# EAGLE design Driver (EAGLE 9.6.2)
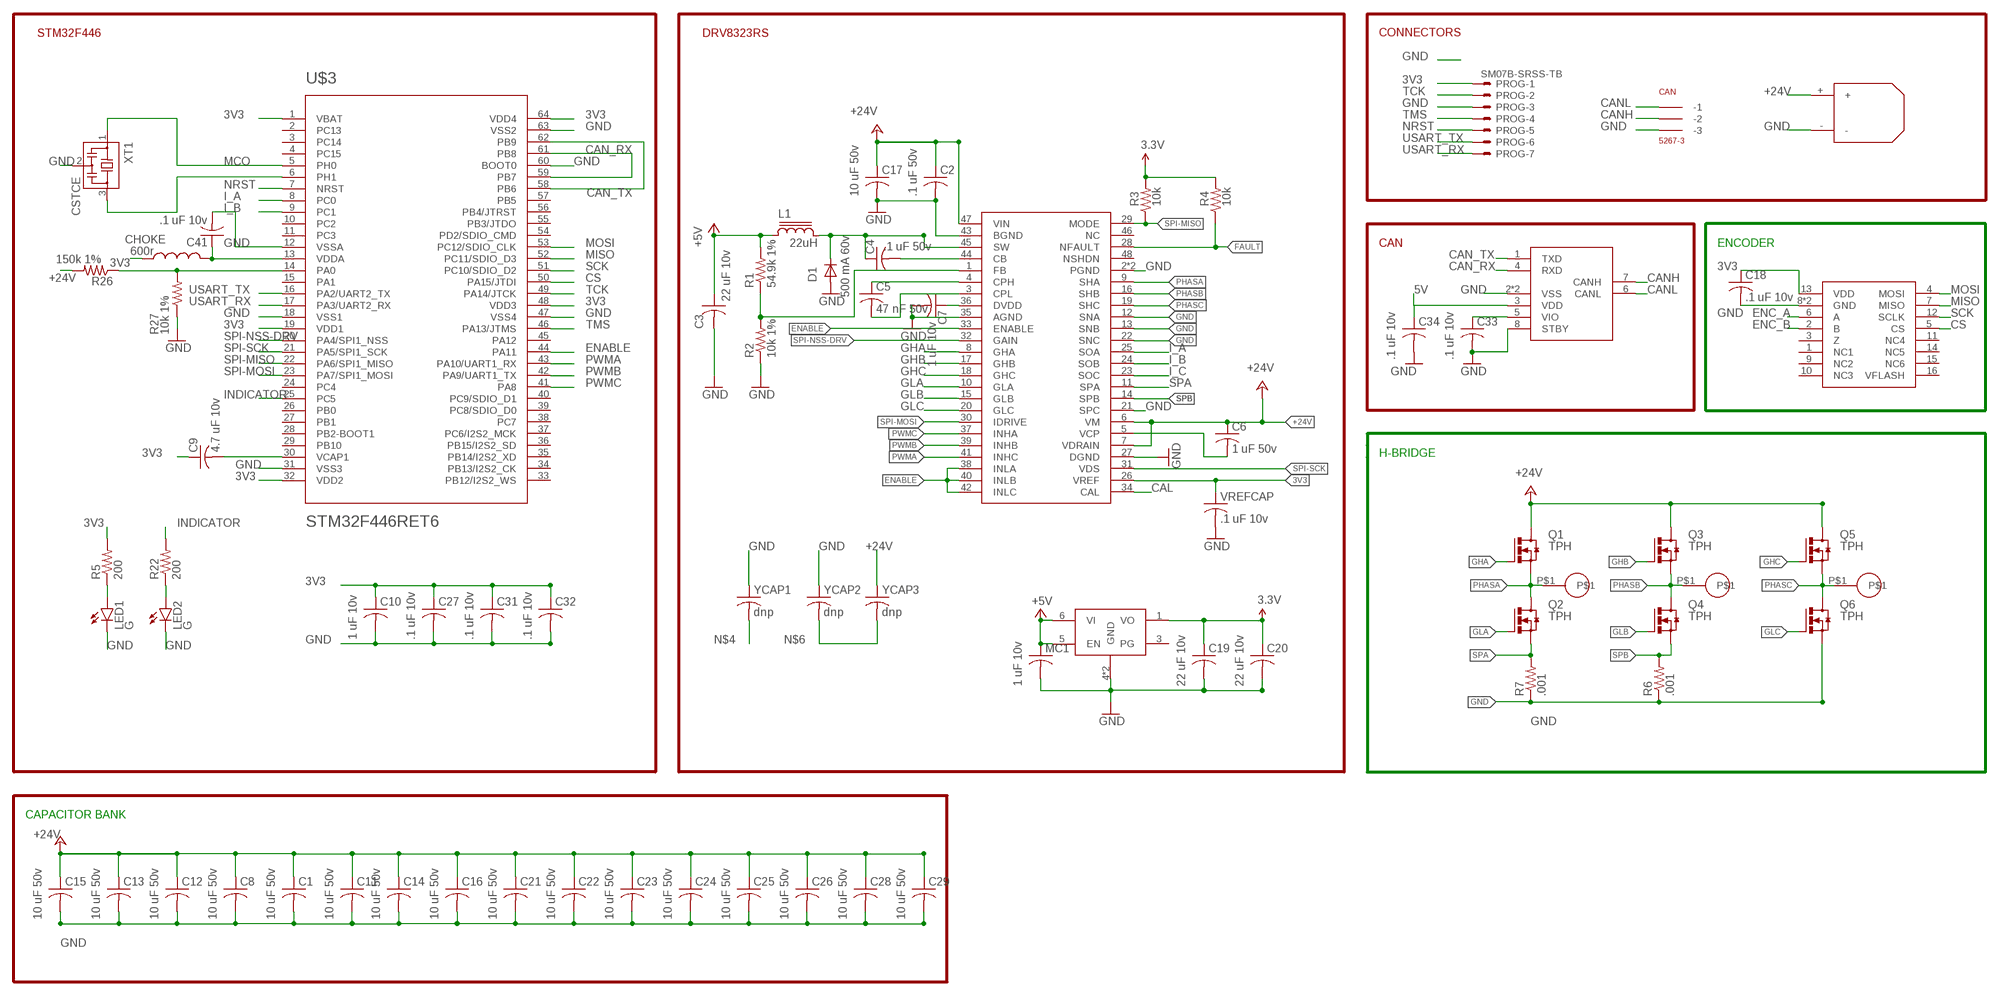
[diagram p0: schematic, sheet 1]

## Parts
C1  10 uF 50v  C-USC1206K  [C1206K]
C2  .1 uF 50v  C-USC0603K  [C0603K]
C3  22 uF 10v  C-USC0603K  [C0603K]
C4  .1 uF 50v  C-USC0603K  [C0603K]
C5  47 nF 50v  C-USC0402K  [C0402K]
C6  1 uF 50v  C-USC0603K  [C0603K]
C7  1 uF 10v  C-USC0402K  [C0402K]
C8  10 uF 50v  C-USC1206K  [C1206K]
C9  4.7 uF 10v  C-USC0402K  [C0402K]
C10  1 uF 10v  C-USC0402K  [C0402K]
C11  10 uF 50v  C-USC1206K  [C1206K]
C12  10 uF 50v  C-USC1206K  [C1206K]
C13  10 uF 50v  C-USC1206K  [C1206K]
C14  10 uF 50v  C-USC1206K  [C1206K]
C15  10 uF 50v  C-USC1206K  [C1206K]
C16  10 uF 50v  C-USC1206K  [C1206K]
C17  10 uF 50v  C-USC1206K  [C1206K]
C18  .1 uF 10v  C-USC0402K  [C0402K]
C19  22 uF 10v  C-USC0603K  [C0603K]
C20  22 uF 10v  C-USC0603K  [C0603K]
C21  10 uF 50v  C-USC1206K  [C1206K]
C22  10 uF 50v  C-USC1206K  [C1206K]
C23  10 uF 50v  C-USC1206K  [C1206K]
C24  10 uF 50v  C-USC1206K  [C1206K]
C25  10 uF 50v  C-USC1206K  [C1206K]
C26  10 uF 50v  C-USC1206K  [C1206K]
C27  .1 uF 10v  C-USC0402K  [C0402K]
C28  10 uF 50v  C-USC1206K  [C1206K]
C29  10 uF 50v  C-USC1206K  [C1206K]
C31  .1 uF 10v  C-USC0402K  [C0402K]
C32  .1 uF 10v  C-USC0402K  [C0402K]
C33  .1 uF 10v  C-USC0402K  [C0402K]
C34  .1 uF 10v  C-USC0402K  [C0402K]
C41  .1 uF 10v  C-USC0402K  [C0402K]
CAN  5267-3  [5267-3]
CHOKE  600r  INDUCTOR0603  [0603]
D1  500 mA 60v  DIODE-SOD123  [SOD123]
L1  22uH  SDR0302  [SDR0302]
LDFM33PUR  LDFM  [DFN6-3X3]
LED1  G  LED0603  [LED-0603]
LED2  G  LED0603  [LED-0603]
MC1  1 uF 10v  C-USC0402K  [C0402K]
PROG  SM07B-SRSS-TB  [SM07B-SRSS-TB]
Q1  TPH  [TRANS_TPH5900CNH,L1Q]
Q2  TPH  [TRANS_TPH5900CNH,L1Q]
Q3  TPH  [TRANS_TPH5900CNH,L1Q]
Q4  TPH  [TRANS_TPH5900CNH,L1Q]
Q5  TPH  [TRANS_TPH5900CNH,L1Q]
Q6  TPH  [TRANS_TPH5900CNH,L1Q]
R1  54.9k 1%  R-US_R0402  [R0402]
R2  10k 1%  R-US_R0402  [R0402]
R3  10k  R-US_R0402  [R0402]
R4  10k  R-US_R0402  [R0402]
R5  200  R-US_R0402  [R0402]
R6  .001  R-US_R1210  [R1210]
R7  .001  R-US_R1210  [R1210]
R22  200  R-US_R0402  [R0402]
R26  150k 1%  R-US_R0402  [R0402]
R27  10k 1%  R-US_R0402  [R0402]
U$1  DRV8323RH  [QFN50P700X700X90-49N]
U$2  18_AWG_PAD  [18_AWG_PAD]
U$3  STM32F446RET6  [TQFP64]
U$4  18_AWG_PAD  [18_AWG_PAD]
U$5  18_AWG_PAD  [18_AWG_PAD]
U$6  MCP2542  [TDFN]
U$9  XT30  [XT30_HORIZONTAL]
U$11  MA700  [QFN16]
VREFCAP  .1 uF 10v  C-USC0402K  [C0402K]
XT1  CSTCE  [CSTCE]
YCAP1  dnp  C-USC0402K  [C0402K]
YCAP2  dnp  C-USC0402K  [C0402K]
YCAP3  dnp  C-USC0402K  [C0402K]

## Nets
3V3: C9.1 C10.1 C18.1 C19.1 C20.1 C27.1 C31.1 C32.1 C33.1 CHOKE.1 LDFM33PUR.1(VO) PROG.1 R3.2 R4.2 R5.2 U$1.26(VREF) U$3.1(VBAT) U$3.19(VDD1) U$3.32(VDD2) U$3.48(VDD3) U$3.64(VDD4) U$6.5(VIO) U$11.13(VDD) VREFCAP.1 ; supply symbol labelled 3.3V
5V: C3.1 C34.1 L1.1 LDFM33PUR.5(EN) LDFM33PUR.6(VI) MC1.1 R1.2 U$6.3(VDD) ; supply symbol labelled +5V
+24V: C1.1 C2.1 C6.1 C8.1 C11.1 C12.1 C13.1 C14.1 C15.1 C16.1 C17.1 C21.1 C22.1 C23.1 C24.1 C25.1 C26.1 C28.1 C29.1 Q1.5(D) Q1.6(D) Q1.7(D) Q1.8(D) Q1.EP(D) Q3.5(D) Q3.6(D) Q3.7(D) Q3.8(D) Q3.EP(D) Q5.5(D) Q5.6(D) Q5.7(D) Q5.8(D) Q5.EP(D) R26.2 U$1.6(VM) U$1.7(VDRAIN) U$1.47(VIN) U$9.+ YCAP3.1
BOOT: C4.2 U$1.44(CB)
CAL: U$1.34(CAL)
CAN_RX: U$3.59(PB7) U$3.61(PB8) U$6.4(RXD)
CAN_TX: U$3.58(PB6) U$3.62(PB9) U$6.1(TXD)
CANH: CAN.P$2(-2) U$6.7(CANH)
CANL: CAN.P$1(-1) U$6.6(CANL)
CPH: C5.1 U$1.4(CPH)
CPL: C5.2 U$1.3(CPL)
CS: U$3.50(PA15/JTDI) U$11.5(CS)
DEVICE3.3: C7.1 U$1.36(DVDD)
ENABLE: U$1.33(ENABLE) U$1.38(INLA) U$1.40(INLB) U$1.42(INLC) U$3.44(PA11)
ENC_A: U$11.6(A)
ENC_B: U$11.2(B)
FAULT: R4.1 U$1.28(NFAULT)
FB: R1.1 R2.2 U$1.1(FB)
GHA: Q1.4(G) U$1.8(GHA)
GHB: Q3.4(G) U$1.17(GHB)
GHC: Q5.4(G) U$1.18(GHC)
GLA: Q2.4(G) U$1.10(GLA)
GLB: Q4.4(G) U$1.15(GLB)
GLC: Q6.4(G) U$1.20(GLC)
GND: C1.2 C2.2 C3.2 C7.2 C8.2 C10.2 C11.2 C12.2 C13.2 C14.2 C15.2 C16.2 C17.2 C18.2 C19.2 C20.2 C21.2 C22.2 C23.2 C24.2 C25.2 C26.2 C27.2 C28.2 C29.2 C31.2 C32.2 C33.2 C34.2 C41.2 CAN.P$3(-3) D1.A LDFM33PUR.4(GND) LDFM33PUR.EXP(GND) LED1.C LED2.C MC1.2 PROG.3 Q6.1(S) Q6.2(S) Q6.3(S) R2.1 R6.1 R7.1 R27.1 U$1.2(PGND) U$1.12(SNA) U$1.13(SNB) U$1.21(SPC) U$1.22(SNC) U$1.27(DGND) U$1.35(AGND) U$1.43(BGND) U$1.49(PGND) U$3.12(VSSA) U$3.18(VSS1) U$3.31(VSS3) U$3.47(VSS4) U$3.60(BOOT0) U$3.63(VSS2) U$6.2(VSS) U$6.8(STBY) U$6.9(VSS) U$9.- U$11.8(GND) U$11.TH(GND) VREFCAP.2 XT1.2 YCAP1.1 YCAP2.1
I_A: U$1.25(SOA) U$3.8(PC0)
I_B: U$1.24(SOB) U$3.9(PC1)
I_C: U$1.23(SOC)
INDICATOR: R22.2 U$3.25(PC5)
MCO: U$3.5(PH0) XT1.1
MISO: U$3.52(PC11/SDIO_D3) U$11.7(MISO)
MOSI: U$3.53(PC12/SDIO_CLK) U$11.4(MOSI)
N$1: LED1.A R5.1
N$2: C41.1 CHOKE.2 U$3.13(VDDA)
N$3: C9.2 U$3.30(VCAP1)
N$4: YCAP1.2
N$6: YCAP2.2 YCAP3.2
N$24: R26.1 R27.2 U$3.14(PA0)
N$28: LED2.A R22.1
N$30: U$3.6(PH1) XT1.3
NRST: PROG.5 U$3.7(NRST)
PHASA: Q1.1(S) Q1.2(S) Q1.3(S) Q2.5(D) Q2.6(D) Q2.7(D) Q2.8(D) Q2.EP(D) U$1.9(SHA) U$4.P$1
PHASB: Q3.1(S) Q3.2(S) Q3.3(S) Q4.5(D) Q4.6(D) Q4.7(D) Q4.8(D) Q4.EP(D) U$1.16(SHB) U$2.P$1
PHASC: Q5.1(S) Q5.2(S) Q5.3(S) Q6.5(D) Q6.6(D) Q6.7(D) Q6.8(D) Q6.EP(D) U$1.19(SHC) U$5.P$1
PWMA: U$1.41(INHC) U$3.43(PA10/UART1_RX)
PWMB: U$1.39(INHB) U$3.42(PA9/UART1_TX)
PWMC: U$1.37(INHA) U$3.41(PA8)
SCK: U$3.51(PC10/SDIO_D2) U$11.12(SCLK)
SPA: Q2.1(S) Q2.2(S) Q2.3(S) R7.2 U$1.11(SPA)
SPB: Q4.1(S) Q4.2(S) Q4.3(S) R6.2 U$1.14(SPB)
SPI-MISO: R3.1 U$1.29(MODE) U$3.22(PA6/SPI1_MISO)
SPI-MOSI: U$1.30(IDRIVE) U$3.23(PA7/SPI1_MOSI)
SPI-NSS-DRV: U$1.32(GAIN) U$3.20(PA4/SPI1_NSS)
SPI-SCK: U$1.31(VDS) U$3.21(PA5/SPI1_SCK)
SW: C4.1 D1.C L1.2 U$1.45(SW)
TCK: PROG.2 U$3.49(PA14/JTCK)
TMS: PROG.4 U$3.46(PA13/JTMS)
USART_RX: PROG.7 U$3.17(PA3/UART2_RX)
USART_TX: PROG.6 U$3.16(PA2/UART2_TX)
VCP: C6.2 U$1.5(VCP)
Unconnected: LDFM33PUR.3(PG) U$1.46(NC) U$1.48(NSHDN) U$3.2(PC13) U$3.3(PC14) U$3.4(PC15) U$3.10(PC2) U$3.11(PC3) U$3.15(PA1) U$3.24(PC4) U$3.26(PB0) U$3.27(PB1) U$3.28(PB2-BOOT1) U$3.29(PB10) U$3.33(PB12/I2S2_WS) U$3.34(PB13/I2S2_CK) U$3.35(PB14/I2S2_XD) U$3.36(PB15/I2S2_SD) U$3.37(PC6/I2S2_MCK) U$3.38(PC7) U$3.39(PC8/SDIO_D0) U$3.40(PC9/SDIO_D1) U$3.45(PA12) U$3.54(PD2/SDIO_CMD) U$3.55(PB3/JTDO) U$3.56(PB4/JTRST) U$3.57(PB5) U$11.1(NC1) U$11.3(Z) U$11.9(NC2) U$11.10(NC3) U$11.11(NC4) U$11.14(NC5) U$11.15(NC6) U$11.16(VFLASH)

## Notes on the sheet
- STM32F446 | DRV8323RS
- CONNECTORS
- CAN | ENCODER
- H-BRIDGE
- CAPACITOR BANK

## Library data of the parts
C1-C29 C31-C34 C41 MC1 VREFCAP YCAP1-YCAP3 = rcl:C-US: CAPACITOR, American symbol
CAN = con-molex-spox:5267-3
CHOKE = SparkFun-Passives:INDUCTOR: Inductors Basic Inductor/Choke - 0603 and 1206. Footprints are not proven and vary greatly between part numbers. INDUCTOR POWER 3.3UH 4.0A SMD 0.197" L x 0.197" W x 0.177" H (5.00mm x 5.00mm x 4.50mm)
D1 = diode:DIODE-: DIODE
L1 = inductor-bourns:SDR0302: POWER INDUCTOR
LDFM33PUR = BenLibrary:LDFM
LED1 LED2 = SparkFun-LED:LED: LEDs Standard schematic elements and footprints for 5mm, 3mm, 1206, and 0603 sized LEDs. 5mm - Spark Fun Electronics SKU : COM-00529 (and others)
PROG = con-jst2:?M07B-SRSS-TB: Disconnectable Crimp style connector, 1.0mm pitch 7 contacts
Q1-Q6 = transistor-power:TPH
R1-R7 R22 R26 R27 = rcl:R-US_: RESISTOR, American symbol
U$1 = BenLibrary:DRV8323RH
U$2 U$4 U$5 = BenLibrary:18_AWG_PAD
U$3 = BenLibrary:STM32F446RET6: ARM DSP Chip used on the WAV Trigger board.
U$6 = BenLibrary:MCP2542
U$9 = Ben_Library:XT30
U$11 = BenLibrary:MA700
XT1 = sc_usercreated:CSTCE

## Board
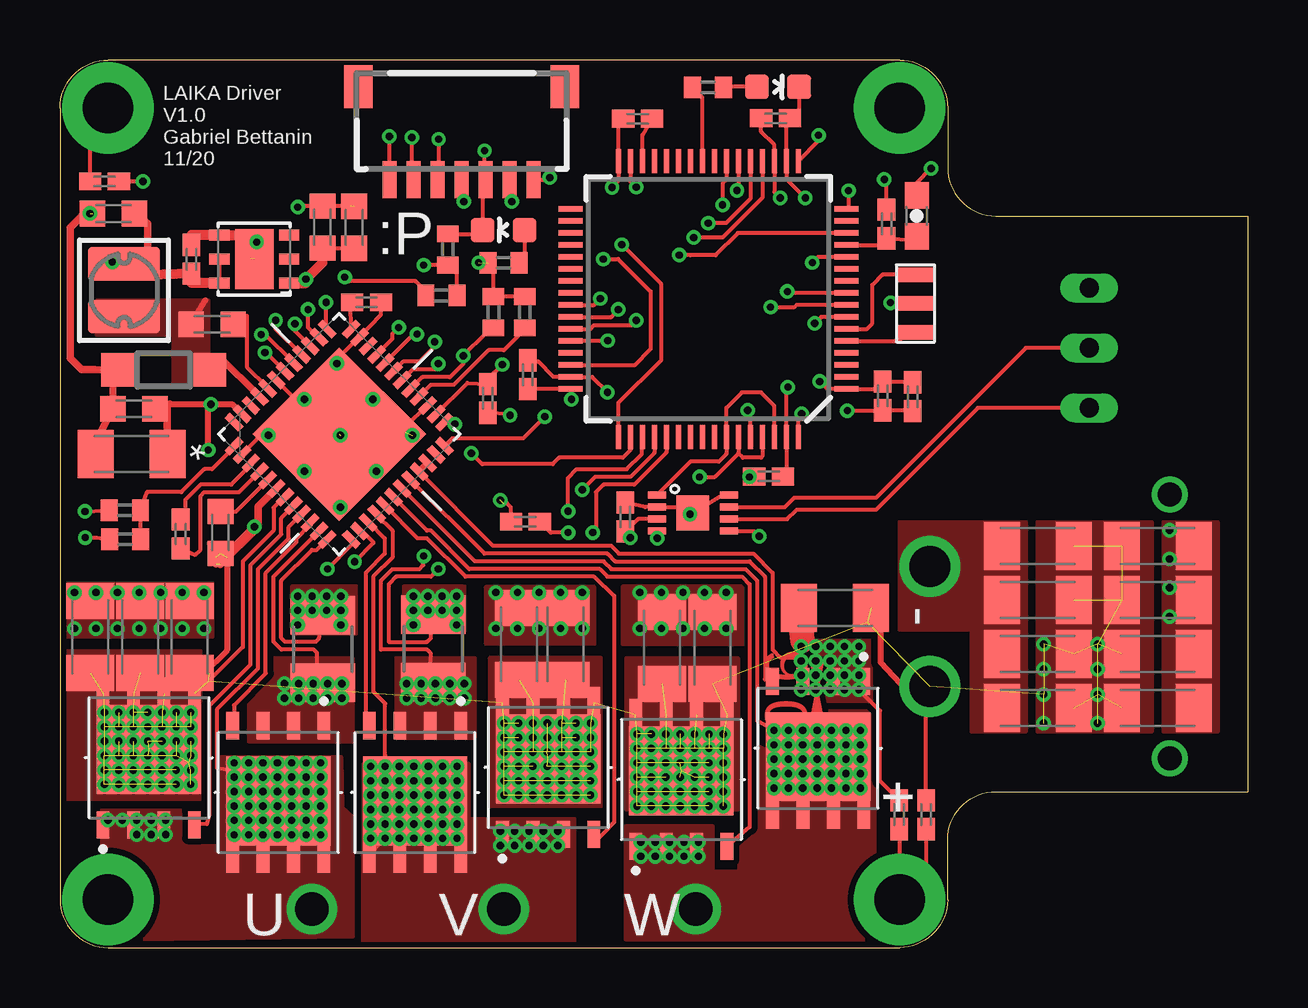
[diagram p1: board, top side]
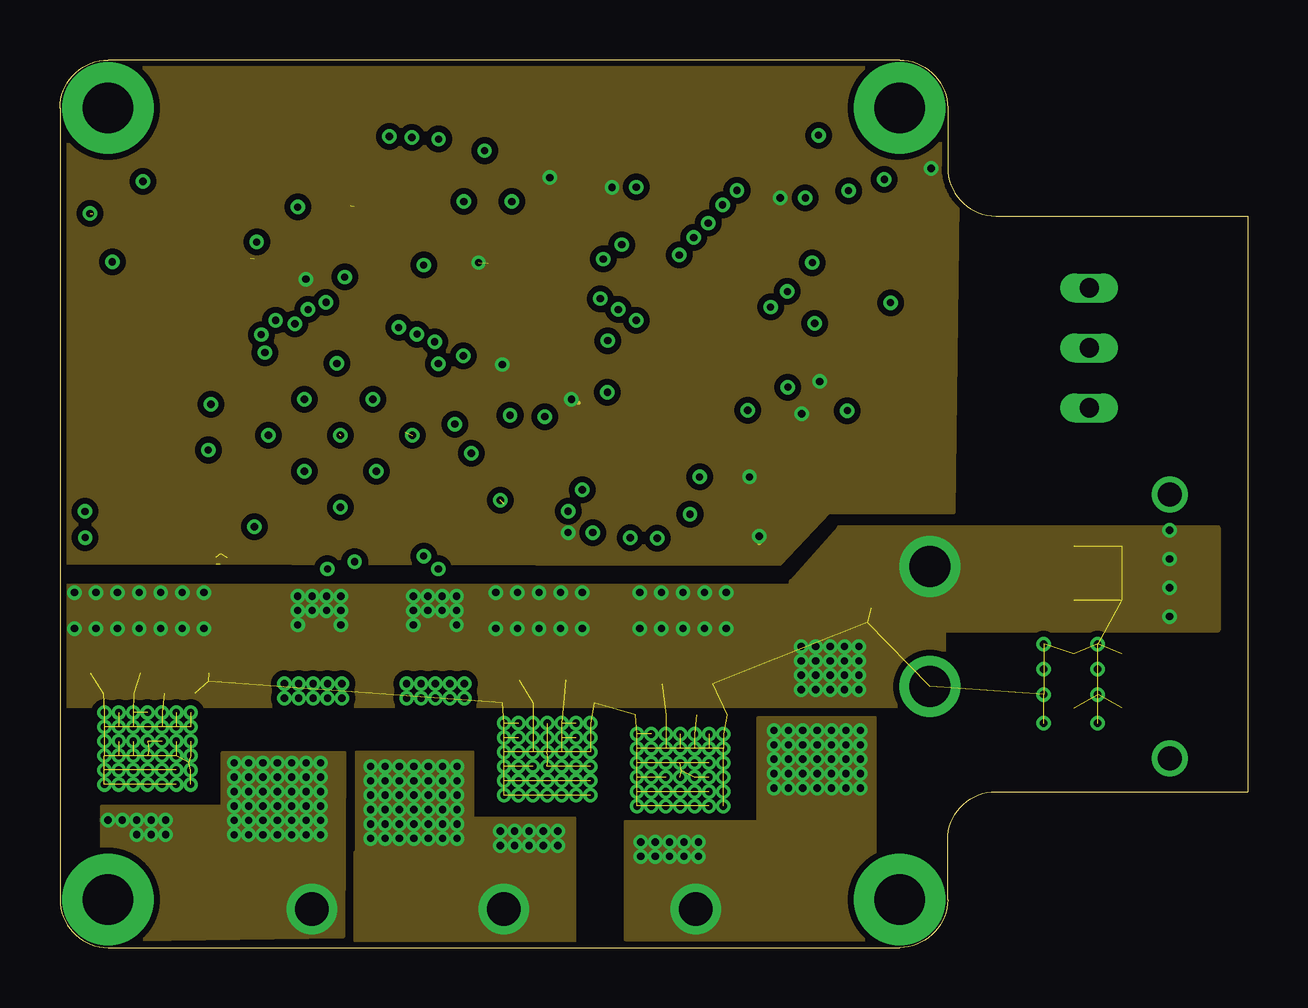
[diagram p2: board, inner layer Route2]
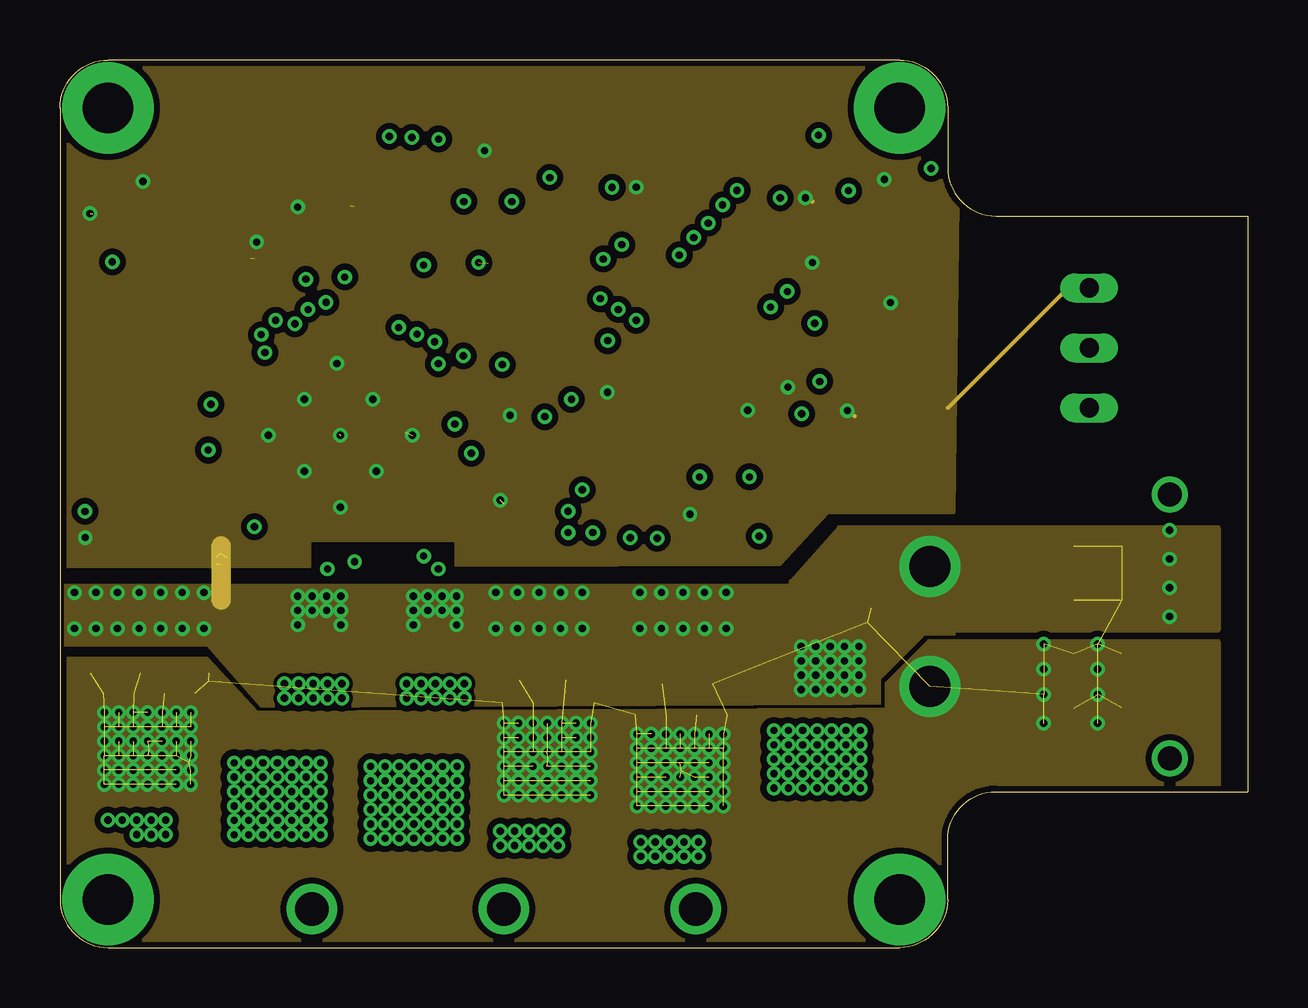
[diagram p3: board, inner layer Route3]
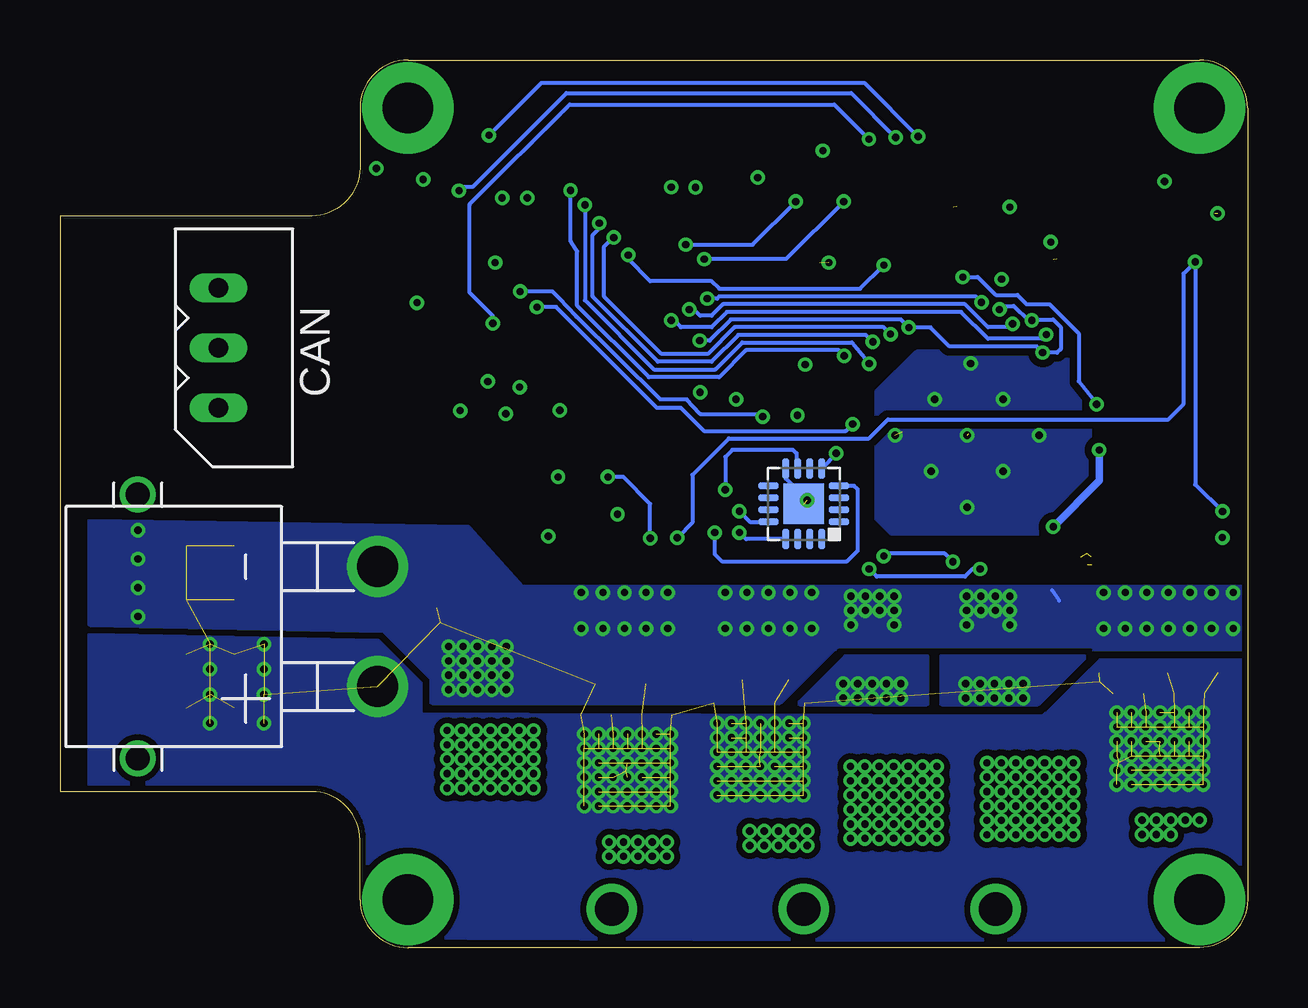
[diagram p4: board, bottom side, seen from below]

Size 49.5 x 37 mm. Coordinates in mm from the lower left corner, seen from the top.
Outline: 2,0 35,0 arc90 37,2 37,4.5 arc-90 39,6.5 49.5,6.5 49.5,30.5 39,30.5 arc-90 37,32.5 37,35 arc90 35,37 2,37 arc90 0,35 0,2 arc90 2,0
Copper layers (1*2+3*16): Top 0.035mm / dielectric 1.5mm / Route2 0.035mm / dielectric 0.15mm / Route3 0.035mm / dielectric 0.2mm / Bottom 0.035mm
Design rules "default *": minimum track width 6mil, minimum drill 0.3mm, track to track 6mil, track to pad 6mil, pad to pad 6mil, via to via 6mil, smd to smd 6mil, copper to edge 6mil, drill to drill 6mil, minimum pad ring 0.15mm, minimum via ring 0.15mm, stop-mask expansion 4mil, vias tented up to drill 12mil, thermal gap 10mil

### Footprints (pad centres in the part's own frame; a part is rotated, then mirrored left to right if it is on the bottom)
C1206K = smd 1.5 x 2: 1 -1.5,0; 2 1.5,0
C0603K = smd 1.05 x 1.08: 1 -0.875,0; 2 0.875,0
C0402K = smd 0.925 x 0.74: 1 -0.6,0; 2 0.6,0
5267-3 = drill 0.8 long: P$1 0,0; P$2 2.5,0; P$3 5,0
0603 = smd 1.1 x 1: 1 -0.85,0; 2 0.85,0
SOD123 = smd 1.4 x 1.4: A 1.9,0; C -1.9,0
SDR0302 = smd 3 x 1.4: 1 0,1.1; 2 0,-1.1
DFN6-3X3 = smd 0.85 x 0.45: 1 -1.45,1; 2 -1.45,0; 3 -1.45,-1; 4 1.45,-1; 5 1.45,0; 6 1.45,1 | smd 1.6 x 2.5: EXP 0,0
LED-0603 = smd 1 x 1: A 0,-0.877; C 0,0.877
SM07B-SRSS-TB = smd 0.6 x 1.55: 1 -3,2.975; 2 -2,2.975; 3 -1,2.975; 4 0,2.975; 5 1,2.975; 6 2,2.975; 7 3,2.975 | smd 1.2 x 1.8: FIT@1 -4.3,-0.9; FIT@2 4.3,-0.9
TRANS_TPH5900CNH,L1Q = smd 1.13 x 0.53: 1 -2.79,1.905; 2 -2.79,0.635; 3 -2.79,-0.635; 4 -2.79,-1.905 | smd 1.33 x 0.53: 5 2.69,-1.905; 6 2.69,-0.635; 7 2.69,0.635; 8 2.69,1.905 | smd 3.7 x 4.35: EP 0.35,0
R0402 = smd 0.7 x 0.9: 1 -0.65,0; 2 0.65,0
R1210 = smd 1.6 x 2.7: 1 -1.4,0; 2 1.4,0
QFN50P700X700X90-49N = smd 0.813 x 0.305: 1 -3.454,2.743; 2 -3.454,2.261; 3 -3.454,1.753; 4 -3.454,1.245; 5 -3.454,0.762; 6 -3.454,0.254; 7 -3.454,-0.254; 8 -3.454,-0.762; 9 -3.454,-1.245; 10 -3.454,-1.753; 11 -3.454,-2.261; 12 -3.454,-2.743; 25 3.454,-2.743; 26 3.454,-2.261; 27 3.454,-1.753; 28 3.454,-1.245; 29 3.454,-0.762; 30 3.454,-0.254; 31 3.454,0.254; 32 3.454,0.762; 33 3.454,1.245; 34 3.454,1.753; 35 3.454,2.261; 36 3.454,2.743 | smd 0.305 x 0.813: 13 -2.743,-3.454; 14 -2.261,-3.454; 15 -1.753,-3.454; 16 -1.245,-3.454; 17 -0.762,-3.454; 18 -0.254,-3.454; 19 0.254,-3.454; 20 0.762,-3.454; 21 1.245,-3.454; 22 1.753,-3.454; 23 2.261,-3.454; 24 2.743,-3.454; 37 2.743,3.454; 38 2.261,3.454; 39 1.753,3.454; 40 1.245,3.454; 41 0.762,3.454; 42 0.254,3.454; 43 -0.254,3.454; 44 -0.762,3.454; 45 -1.245,3.454; 46 -1.753,3.454; 47 -2.261,3.454; 48 -2.743,3.454 | smd 5.105 x 5.105: 49 0,0
18_AWG_PAD = drill 1.4: P$1 0,0
TQFP64 = smd 0.22 x 1: 1 -3.75,-5.75; 2 -3.25,-5.75; 3 -2.75,-5.75; 4 -2.25,-5.75; 5 -1.75,-5.75; 6 -1.25,-5.75; 7 -0.75,-5.75; 8 -0.25,-5.75; 9 0.25,-5.75; 10 0.75,-5.75; 11 1.25,-5.75; 12 1.75,-5.75; 13 2.25,-5.75; 14 2.75,-5.75; 15 3.25,-5.75; 16 3.75,-5.75; 33 3.75,5.75; 34 3.25,5.75; 35 2.75,5.75; 36 2.25,5.75; 37 1.75,5.75; 38 1.25,5.75; 39 0.75,5.75; 40 0.25,5.75; 41 -0.25,5.75; 42 -0.75,5.75; 43 -1.25,5.75; 44 -1.75,5.75; 45 -2.25,5.75; 46 -2.75,5.75; 47 -3.25,5.75; 48 -3.75,5.75 | smd 1 x 0.22: 17 5.75,-3.75; 18 5.75,-3.25; 19 5.75,-2.75; 20 5.75,-2.25; 21 5.75,-1.75; 22 5.75,-1.25; 23 5.75,-0.75; 24 5.75,-0.25; 25 5.75,0.25; 26 5.75,0.75; 27 5.75,1.25; 28 5.75,1.75; 29 5.75,2.25; 30 5.75,2.75; 31 5.75,3.25; 32 5.75,3.75; 49 -5.75,3.75; 50 -5.75,3.25; 51 -5.75,2.75; 52 -5.75,2.25; 53 -5.75,1.75; 54 -5.75,1.25; 55 -5.75,0.75; 56 -5.75,0.25; 57 -5.75,-0.25; 58 -5.75,-0.75; 59 -5.75,-1.25; 60 -5.75,-1.75; 61 -5.75,-2.25; 62 -5.75,-2.75; 63 -5.75,-3.25; 64 -5.75,-3.75
TDFN = smd 0.3 x 0.75: 1 0,-3; 2 0.5,-3; 3 1,-3; 4 1.5,-3; 5 1.5,0; 6 1,0; 7 0.5,0; 8 0,0 | smd 1.46 x 1.36: 9 0.75,-1.5
XT30_HORIZONTAL = drill 1.7: + -2.5,0; - 2.5,0 | drill 1: P$3 5.5,10; P$4 -5.5,10
QFN16 = smd 0.85 x 0.3: 1 -1.475,0.75; 2 -1.475,0.25; 3 -1.475,-0.25; 4 -1.475,-0.75; 9 1.475,-0.75; 10 1.475,-0.25; 11 1.475,0.25; 12 1.475,0.75 | smd 0.3 x 0.85: 5 -0.75,-1.475; 6 -0.25,-1.475; 7 0.25,-1.475; 8 0.75,-1.475; 13 0.75,1.475; 14 0.25,1.475; 15 -0.25,1.475; 16 -0.75,1.475 | smd 1.7 x 1.7: TH 0,0
CSTCE = smd 0.6 x 1.6: 1 -1.2,0; 2 0,0; 3 1.2,0

### Placement (x,y rotation side)
C1  19.13,12.65 90 top
C2  3.08,22.46 180 top
C3  2.23,30.59 180 top
C4  6.34,25.98 0 top
C5  5.03,17.24 90 top
C6  6.69,17.3 90 top
C7  12.78,26.9 0 top
C8  5.4,12.95 90 top
C9  24.08,34.55 0 top
C10  35.54,22.96 270 top
C11  3.35,12.95 90 top
C12  27.19,12.5 90 top
C13  25.09,12.5 90 top
C14  21.07,12.65 90 top
C15  1.25,12.95 90 top
C16  32.31,14.15 180 top
C17  2.98,20.58 180 top
C18  19.4,17.75 180 top
C19  10.94,30.03 90 top
C20  12.26,30.02 90 top
C21  45.75,14.5 0 top
C22  40.75,16.75 180 top
C23  40.75,14.5 180 top
C24  40.75,12.25 180 top
C25  40.75,10 180 top
C26  45.75,16.75 0 top
C27  29.83,34.57 0 top
C28  45.75,12.25 0 top
C29  45.75,10 0 top
C31  34.29,23 270 top
C32  19.5,23.88 90 top
C33  29.54,19.64 0 top
C34  23.56,17.95 90 top
C41  34.45,30.16 90 top
CAN  42.9,22.5 90 bottom
CHOKE  35.71,30.5 270 top
D1  4.32,24.08 180 top
L1  2.67,27.4 0 top
LDFM33PUR  8.1,28.7 180 top
LED1  18.49,29.91 90 top
LED2  29.93,35.88 270 top
MC1  5.48,28.69 90 top
PROG  16.74,34.98 180 top
Q1  3.7,7.91 90 top
Q2  9.1,6.46 270 top
Q3  20.35,7.51 90 top
Q4  14.8,6.46 270 top
Q5  25.9,7.01 90 top
Q6  31.6,8.31 270 top
R1  2.7,18.23 180 top
R2  2.72,17.02 0 top
R3  18.07,26.48 90 top
R4  19.38,26.48 90 top
R5  18.49,28.54 180 top
R6  15.56,12.47 270 top
R7  10.96,12.45 270 top
R22  27.01,35.85 180 top
R26  15.9,27.18 180 top
R27  16.17,29.1 270 top
U$1  11.64,21.4 45 top
U$2  18.5,1.6 0 top
U$3  27.03,27.04 90 top
U$4  10.5,1.6 0 top
U$5  26.5,1.6 0 top
U$6  27.88,18.86 270 top
U$9  36.26,13.38 90 bottom
U$11  18.5,18.5 180 bottom
VREFCAP  17.83,22.89 270 top
XT1  35.66,26.85 90 top
YCAP1  1.86,31.94 180 top
YCAP2  34.98,5.54 270 top
YCAP3  36.1,5.54 270 top

### Tracks (layer width: path | path; a pad name or v marks a point on that pad's centre or on a via)
3V3  (via drill 0.3)  (1 unrouted)
  Top 0.16: R4.2 R3.2 18.07,28.31 R5.2 | v21.32,22.85 21.28,22.89 U$3.48 C32.1 | U$3.64 30.78,22.11 v30.92,22.25 | v31.67,23.6 31.98,23.29 U$3.1 34.29,23.29 C31.1 35.54,23.6 C10.1 | v30.02,31.25 29.78,31.49 U$3.19 29.78,33.46 29.22,34.02 C27.1 | U$6.5 28.94,17.36 v29.15,17.15 | v21.18,17.3 20.45,17.3 C18.1 | CHOKE.1 35.71,31.88 v36.31,32.48 | 28.72,19.62 v28.74,19.62 28.76,19.64 C33.1 | C9.1 23.28,34.31 U$3.32 23.28,31.96 v23.01,31.69 | U$1.26 16.98,23.54 VREFCAP.1 17.83,23.69 v18.44,24.3 | C20.1 C19.1 | PROG.1 20.42,32.01 v20.42,32.1
  Top 0.406: LDFM33PUR.1 10.25,27.7 v10.25,27.86 10.94,28.55 C19.1
  Route2 0.16: v21.32,22.85 21.47,22.85 21.62,22.7 | v30.92,22.25 31.07,22.4 | v31.67,23.6 31.67,23.75 | v30.02,31.25 30.17,31.1 | v29.15,17.15 29.15,16.85
  Bottom 0.16: U$11.13 20.91,17.02 v21.18,17.3
  other vias: 17.45,28.55
  pour Route2 (isolate 0.254, no thermals): -0.5,16.05 30,16 32.05,18.15 37.25,18.15 37.5,37.5 -0.5,37.5
5V  (via drill 0.3)
  Top 0.16: L1.1 2.26,28.5 v2.18,28.58 | v1.04,18.18 1.15,18.18 R1.2 | v23.77,17.08 23.77,17.3 C34.1 23.59,17.35 24.1,17.86 U$6.3 | LDFM33PUR.6 LDFM33PUR.5
  Top 0.2: 3.65,28.5 3.25,28.9
  Top 0.26: 3.7,28.95 3.25,28.9 L1.1
  Top 0.305: C3.1 3.65,30.17 3.65,28.5
  Top 0.406: 3.65,28.5 3.65,28.04 MC1.1 5.48,27.7 LDFM33PUR.6
  Bottom 0.16: v1.04,18.18 2.18,19.3 v2.18,28.58 2.66,28.1 2.66,22.66 3.3,22.02 14.98,22.02 15.78,21.22 21.62,21.22 23.14,19.7 23.14,17.71 v23.77,17.08
+24V  (via drill 0.3, 0.3 pad 0.25)  (170 unrouted)
  Top 0.16: Q1.5 5.36,7.71 | C6.1 6.2,16.84 | 6.2,11.45 6.02,11.45 C8.1 | 6.18,11.09 7.62,12.53 7.62,16.1 8.9,17.38 8.9,18.34 9.34,18.78 U$1.7 | R26.2 15.25,27.35 14.82,27.78 12.04,27.78 v11.87,27.95 | YCAP3.1 36.1,10.35 35.6,10.4
  Top 0.25: 6.96,15.96 6.96,16.26
  Top 0.26: 6.52,16.28 6.5,15.96 | v6.29,22.65 7.17,22.65 U$1.47 | C2.1 4.58,22.65 v6.29,22.65 | 33.65,13.55 34.2,13.25 34.2,11.9 35.6,10.4 | 6.96,15.96 6.96,12.39 6.02,11.45 | v6.18,20.74 6.18,22.54 v6.29,22.65
  Top 0.305: C17.1 4.46,22.53 4.58,22.65 | U$1.6 8.26,18.38 8.26,17.54 6.68,15.96 | v8.1,17.54 6.66,16.11 C6.1
  Bottom 0.16: v6.29,22.65 7.04,23.6 7.04,25.6 8.26,26.82 9.21,26.82 9.59,27.2 10.49,27.2 11.24,27.95 v11.87,27.95
  Bottom 0.305: v6.18,20.74 6.18,19.46 v8.1,17.54
  other vias: 27.65,8.3 27.65,7.7 27.65,7.1 27.65,6.5 27.65,5.9 24.05,8.3 24.05,7.7 24.05,7.1 24.05,6.5 24.05,5.9 24.65,8.3 24.65,7.7 24.65,7.1 24.65,6.5 24.65,5.9 25.25,8.3 25.25,7.7 25.25,7.1 25.25,6.5 25.25,5.9 25.85,8.3 25.85,7.7 25.85,7.1 25.85,6.5 25.85,5.9 26.45,8.3 26.45,7.7 26.45,7.1 26.45,6.5 26.45,5.9 27.05,8.3 27.05,7.7 27.05,7.1 27.05,6.5 27.05,5.9 18.51,8.75 18.51,8.15 18.51,7.55 18.51,6.95 18.51,6.35 19.11,8.75 19.11,8.15 19.11,7.55 19.11,6.95 19.11,6.35 19.71,8.75 19.71,8.15 19.71,7.55 19.71,6.95 19.71,6.35 20.31,8.75 20.31,8.15 20.31,7.55 20.31,6.95 20.31,6.35 20.91,8.75 20.91,8.15 20.91,7.55 20.91,6.95 20.91,6.35 21.51,8.75 21.51,8.15 21.51,7.55 21.51,6.95 21.51,6.35 22.11,8.75 22.11,8.15 22.11,7.55 22.11,6.95 22.11,6.35 1.85,9.2 1.85,8.6 1.85,8 1.85,7.4 1.85,6.8 2.45,9.2 2.45,8.6 2.45,8 2.45,7.4 2.45,6.8 3.05,9.2 3.05,8.6 3.05,8 3.05,7.4 3.05,6.8 3.65,9.2 3.65,8.6 3.65,8 3.65,7.4 3.65,6.8 4.25,9.2 4.25,8.6 4.25,8 4.25,7.4 4.25,6.8 4.85,9.2 4.85,8.6 4.85,8 4.85,7.4 4.85,6.8 5.45,9.2 5.45,8.6 5.45,8 5.45,7.4 5.45,6.8 24.05,8.9 24.65,8.9 25.25,8.9 25.85,8.9 26.45,8.9 27.05,8.9 27.65,8.9 18.51,9.35 19.11,9.35 19.71,9.35 20.31,9.35 20.91,9.35 21.51,9.35 22.11,9.35 1.85,9.8 2.45,9.8 3.05,9.8 3.65,9.8 4.25,9.8 4.85,9.8 5.45,9.8 43.25,9.35 43.25,10.55 43.25,11.6 43.25,12.65 41,12.65 41,11.6 41,10.55 41,9.35
  pour Bottom (isolate 0.254, rank 2, no thermals): 37.1,9.75 8.52,9.65 6.12,12 -0.2,12 -0.35,0.25 37.25,0.4
  pour Top (no thermals): 23.61,12.07 28.26,12.07 28.26,5.75 23.61,5.75
  pour Top (no thermals): 22.56,5.9 22.56,12.07 17.91,12.07 17.91,5.9
  pour Top (isolate 0.254, no thermals): -0.1,6.2 5.87,6.2 5.87,12.35 -0.1,12.35
  pour Route3 (isolate 0.254, rank 3, no thermals): -0.25,12.05 6.12,12.05 8.2,9.8 37.4,9.95 37.55,-0.55 -0.25,-0.55
  pour Bottom (isolate 0.254, rank 2, no thermals): 34.5,0.25 34.5,11 36.25,12.75 48.25,13 48.25,0.5
  pour Route3 (isolate 0.254, rank 2, no thermals): 48.25,12.75 48.25,0 34.5,0 34.5,11 36.25,12.75
  pour Top (isolate 0.254, rank 2, no thermals): 40.75,17.75 45.5,17.75 45.5,9 40.75,9
BOOT
  Top 0.16: C4.2 7.79,26.34 7.79,24.2 8.63,23.36 U$1.44
CAN_RX  (via drill 0.3)
  Top 0.16: U$3.59 28.28,20.6 | 28.28,20.6 27.3,19.62 v26.66,19.62 | U$6.4 24.88,17.24 v24.9,17.06 | U$3.61 29.28,20.48 29.22,20.42 28.46,20.42 28.28,20.6
  Bottom 0.16: v24.9,17.06 24.9,18.5 26.02,19.62 v26.66,19.62
CAN_TX
  Top 0.16: U$3.62 29.78,22.58 29.22,23.14 28.42,23.14 27.78,22.5 U$3.58 27.78,20.58 27.46,20.26 26.28,20.26 U$6.1
CANH
  Top 0.16: U$6.7 30.21,18.36 30.6,18.75 34,18.75 40.25,25 CAN.P$2
CANL
  Top 0.16: U$6.6 30.31,17.86 30.7,18.25 34,18.25 38.25,22.5 CAN.P$1
CPH
  Top 0.16: C5.1 5.64,16.37 5.86,16.58 5.86,18.82 6.02,18.98 7.46,18.98 U$1.4
CPL
  Top 0.16: U$1.3 7.96,20.12 7.14,19.3 5.86,19.3 5.22,18.66 5.22,18.3 C5.2
CS  (via drill 0.3)
  Top 0.16: v17.15,20.6 17.6,20.15 20.54,20.15 20.81,20.42 23.46,20.42 23.78,20.74 U$3.50
  Bottom 0.16: v17.15,20.6 17.15,20.57 U$11.5
DEVICE3.3
  Top 0.16: U$1.36 12.11,26.83 C7.1
ENABLE  (via drill 0.3)
  Top 0.16: U$3.44 21.32,25.25 21.37,25.3 v22.83,25.3 | U$1.42 8.43,24.95 v8.54,24.8 | U$1.38 10.74,25.45 10.34,25.85 v10.34,26.6 | U$1.40 8.99,25.79 v8.99,26.15 | U$1.33 | U$1.33 13.86,25.38 13.86,25.59 v14.12,25.85
  Bottom 0.16: v10.34,26.6 10.19,26.75 9.74,26.75 9.14,26.15 v8.99,26.15 8.96,26.18 8.1,26.18 7.79,25.87 7.79,24.95 7.94,24.8 v8.54,24.8 8.8,25.06 12.42,25.06 13.21,25.85 v14.12,25.85 14.45,26.18 21.54,26.18 22.42,25.3 v22.83,25.3
FAULT
  Top 0.16: U$1.28 15.46,23.46 16.42,23.46 17.86,24.9 18.5,24.9 19.38,25.78 R4.1
FB
  Top 0.16: U$1.1 7.26,20.86 6.34,19.94 6.02,19.94 5.06,18.98 3.62,18.98 R1.1 3.37,18.21 R2.2
GHA
  Top 0.16: U$1.8 9.22,17.9 9.22,17.22 7.94,15.94 7.94,11.8 6.22,10.08 6.22,5.55 6.12,5.15 Q1.4
GHB
  Top 0.16: Q3.4 22.18,4.26 23.1,5.22 23.1,14.66 22.26,15.46 16.9,15.46 15.3,17.06 14.9,17.06 U$1.17
GHC
  Top 0.16: U$1.18 15.3,17.38 15.46,17.38 17.06,15.78 22.5,15.78 22.82,15.46 28.42,15.46 28.74,15.14 28.74,5.03 Q5.4
GLA
  Top 0.16: Q2.4 7.25,9.3 7.25,10.1 8.58,11.43 8.58,15.62 9.86,16.9 9.86,17.06 10.44,17.64 U$1.10
GLB
  Top 0.16: U$1.15 12.88,17.72 13.54,17.06 13.54,16.42 12.74,15.62 12.74,9.4 Q4.4
GLC
  Top 0.16: Q6.4 29.38,11.18 29.38,15.46 28.74,16.1 23.14,16.1 22.82,16.42 17.7,16.42 U$1.20
GND  (via drill 0.3)  (6 unrouted)
  Top 0.16: 10.7,13.1 10.7,14.1 R7.1 10.8,12.88 10.66,12.74 9.38,12.74 9.22,12.9 9.22,15.3 10.5,16.58 10.7,16.58 U$1.12 | U$1.43 11.25,21.41 U$1.49 | U$1.2 8.41,21.41 U$1.49 | U$1.27 14.39,21.71 14.39,21.5 | U$1.49 11.61,24.61 U$1.35 13.38,26.38 C7.2 | v22.82,23.15 22.18,23.79 U$3.47 20.57,23.79 19.94,24.42 19.56,24.42 C32.2 | U$3.12 31.6,28.79 v31.36,28.55 | v31.07,31.25 30.28,32.04 U$3.18 30.28,34.42 C27.2 30.81,34.95 LED2.C | U$3.31 23.78,31.94 v24.02,31.7 | U$6.9 26.61,18.36 U$6.2 24.39,18.36 C34.2 | U$6.9 26.86,17.94 v26.26,18.06 | U$3.60 28.78,22.29 v28.67,22.4 | 14.98,19.78 14.98,19.94 15.24,20.2 U$1.22 U$1.21 18.06,16.74 22.98,16.74 23.3,16.42 28.9,16.42 29.7,15.62 29.7,12.42 30.02,12.1 30.75,12.1 v30.9,11.95 | 15.77,13.45 15.46,13.46 15.46,12.9 15.3,12.74 13.7,12.74 13.7,15.14 14.02,15.46 15.46,15.46 v15.77,15.77 v15.77,15.78 | C18.2 18.8,18.35 18.5,18.65 v18.35,18.65 | v30.34,23.36 30.28,23.3 U$3.63 30.28,19.94 C33.2 | v32.82,22.38 34.29,22.38 C31.2 35.54,22.4 C10.2 | XT1.2 34.65,26.85 v34.62,26.88 | C41.2 34.45,31.93 v34.36,32.02 | U$6.8 27.61,18.86 U$6.9 | 17.72,30.02 LED1.C | U$1.13 12.14,16.77 v11.15,15.78 | R27.1 17.45,29.75 LED1.C | v1.05,17.09 1.52,17.09 R2.1 | v18.76,22.19 18.71,22.24 VREFCAP.2 | YCAP1.1 v3.46,31.94 | v33.3,10.75 34.18,9.87 34.18,6.94 YCAP2.1 | 12.12,30.91 C19.2 9.95,30.91 v9.91,30.87 | v17.7,33.22 17.7,32.01 PROG.3 17.61,32.01 LED1.C
  Top 0.26: D1.A 2.2,24.05 | 1.32,30.71 C3.2
  Top 0.3: 2.2,24.05 C2.2
  Top 0.305: D1.A 1.44,24.1 0.9,24.1 0.42,24.58 0.42,30.02 1,30.6 v1.25,30.6 | C17.2 1.66,21.41 C2.2 | v8.2,29.41 7.94,28.71
  Top 0.406: 30.95,12.8 v30.9,12.55 | MC1.2 5.48,29.7 LDFM33PUR.4 8.1,29.7 LDFM33PUR.EXP
  Top 1.016: C16.2 30.95,12.8
  Route3 0.16: v22.82,23.15 22.67,23.15 22.82,23 | v32.82,22.38 33.13,22.15 | v31.07,31.25 31.37,31.1 | v24.02,31.7 24.17,31.7 | v26.26,18.06 26.26,17.91 | v28.67,22.4 28.52,22.55 | v30.34,23.36 30.19,23.51 | CAN.P$3 42,27.5 37,22.5
  Route3 0.813: 6.72,16.74 6.72,14.5
  Bottom 0.16: 8.15,14.9 7.85,14.45 | 18.2,18.95 18.26,19.01 v18.35,18.65 19.25,19.55 U$11.8 | v11.15,15.78 11.46,15.78 11.78,15.46 15.45,15.46 v15.77,15.78
  other vias: 33.3,11.95 9.91,13.45 8.69,21.35 32.7,11.95 32.1,11.95 31.5,11.95 31.5,12.55 32.1,12.55 32.7,12.55 33.3,12.55 18.17,14.8 16.53,13.45 14.73,13.45 16.53,14.05 15.93,14.05 15.33,14.05 14.73,14.05 14.73,14.65 15.33,14.65 15.93,14.65 16.53,14.65 11.71,13.45 11.71,14.05 11.11,14.05 10.51,14.05 9.91,14.05 9.91,14.65 10.51,14.65 11.11,14.65 11.71,14.65 0.6,14.8 11.69,18.35 14.69,21.35 11.54,24.35 10.19,22.85 13.19,19.85 11.69,21.35 13.04,22.85 10.19,19.85 30.9,11.35 31.5,11.35 32.1,11.35 32.7,11.35 33.3,11.35 32.7,10.75 32.1,10.75 31.5,10.75 30.9,10.75 1.5,14.8 2.4,14.8 3.3,14.8 4.2,14.8 5.1,14.8 6,14.8 0.6,13.3 1.5,13.3 2.4,13.3 3.3,13.3 4.2,13.3 5.1,13.3 6,13.3 18.17,13.3 19.07,14.8 19.97,14.8 20.87,14.8 21.77,14.8 19.07,13.3 19.97,13.3 20.87,13.3 21.77,13.3 24.17,14.8 25.07,14.8 25.97,14.8 26.87,14.8 27.77,14.8 24.17,13.3 25.07,13.3 25.97,13.3 26.87,13.3 27.77,13.3 46.25,17.4 46.25,16.2 46.25,15 46.25,13.8
  pour Route3 (isolate 0.254, no thermals): -0.5,15.9 10.4,15.9 10.4,17 16.51,17 16.51,15.95 30,16 32,18.15 37.25,18.15 37.5,37.5 -0.5,37.5
  pour Top (isolate 0.254, rank 2, no thermals): 14.32,13.21 16.87,13.21 16.87,15.05 14.32,15.05
  pour Top (no thermals): 17.77,15.05 22.27,15.05 22.27,12.65 17.77,12.65
  pour Top (no thermals): 23.45,12.65 28.56,12.65 28.56,15.05 23.45,15.05
  pour Top (isolate 0.254, no thermals): -0.25,15.18 6.35,15.18 6.35,12.95 -0.25,12.95
  pour Top (isolate 0.254, rank 2, no thermals): 30.55,12.8 33.81,12.8 33.81,9.65 30.5,9.65
  pour Route3 (rank 3, no thermals): -0.25,15.05 37.25,15.05 37.1,10.25 8.44,10.1 6.2,12.65 -0.25,12.65
  pour Top (isolate 0.254, rank 2, no thermals): 12.37,13.1 12.37,15.05 9.66,15.05 9.66,13.1
  pour Route2 (isolate 0.254, rank 4, no thermals): 0.2,15.05 36.8,15.05 36.8,10.1 0.2,10.1
  pour Bottom (isolate 0.305, rank 2, no thermals): 7.34,24.8 13.79,24.8 15.44,23.15 15.44,17.9 14.84,17.3 7.49,17.3 6.59,18.2 6.59,24.05
  pour Bottom (isolate 0.254, rank 2, no thermals): 0.25,15 30.25,15 32.5,17.5 48.25,17.75 48.25,13.5 36,13.25 34,11.25 34,10.25 19.5,10.25 17.25,12.5 0.25,12.5
  pour Route3 (isolate 0.254, rank 2, no thermals): 48.25,17.5 48.25,13.25 34.75,13.25 30.25,13.75 30.5,15.25 32.5,17.5
  pour Route2 (isolate 0.254, rank 2, no thermals): 48.25,17.5 48.25,13.25 34.75,13.25 30.25,13.5 30.5,15.25 32.5,17.5
  pour Top (isolate 0.254, rank 2, no thermals): 46,17.75 48.25,17.75 48.25,9 46,9
  pour Top (isolate 0.254, rank 2, no thermals): 40.25,17.75 40.25,9 38,9 38,13.25 35,13.25 35,17.75
I_A  (via drill 0.3)
  Top 0.16: v29.62,26.7 30.62,26.7 30.71,26.79 U$3.8 | U$1.25 16.38,21.9 v16.46,21.82
  Bottom 0.16: v29.62,26.7 28.82,26.7 24.62,22.5 23.62,22.5 22.66,21.54 16.74,21.54 v16.46,21.82
I_B  (via drill 0.3)
  Top 0.16: U$3.9 30.38,27.29 v30.32,27.35 | v20.21,22.13 19.3,21.22 16.34,21.22 U$1.24
  Bottom 0.16: v30.32,27.35 28.97,27.35 28.67,27.05 27.97,26.3 24.47,22.85 23.38,22.85 22.82,22.25 20.33,22.25 v20.21,22.13
INDICATOR
  Top 0.16: U$3.25 26.78,35.43 R22.2
MCO
  Top 0.16: U$3.5 34.82,25.29 XT1.1
MISO  (via drill 0.3)
  Top 0.16: U$3.52 24.78,20.62 23.78,19.62 22.31,19.62 v21.77,19.08
  Bottom 0.16: U$11.7 18.8,20.02 18.8,20.6 18.95,20.75 21.47,20.75 21.77,20.45 v21.77,19.08
MOSI  (via drill 0.3)
  Top 0.16: U$3.53 25.28,20.64 23.94,19.3 22.66,19.3 22.34,18.98 22.34,17.43 v22.21,17.3
  Bottom 0.16: v22.21,17.3 22.21,16.4 21.91,16.1 16.7,16.1 16.25,16.55 16.25,19.1 16.4,19.25 U$11.4
N$1
  Top 0.16: LED1.A 19.37,28.77 R5.1
N$2
  Top 0.16: CHOKE.2 35.57,29.51 C41.1 34.23,29.29 U$3.13
N$3
  Top 0.16: U$3.30 24.28,33.88 C9.2
N$4  (via drill 2.1 pad 3.8)
  Top 0.16: YCAP1.2 1.26,34.26 v2,35
N$5  (via drill 2.1 pad 3.8)
  other vias: 35,35
N$6  (via drill 2.1 pad 3.8)
  Top 0.16: YCAP2.2 34.98,2.02 v35,2 36.1,3.1 YCAP3.2
N$7  (via drill 2.1 pad 3.8)
  other vias: 2,2
N$24  (via drill 0.3)
  Top 0.16: U$3.14 28.26,29.79 27.33,28.86 26.28,28.86 v25.81,28.87 | R26.1 16.55,28.07 R27.2 v15.16,28.45
  Bottom 0.16: v25.81,28.87 25.81,28.69 24.9,27.78 22.34,27.78 22.02,27.46 16.15,27.46 v15.16,28.45
N$28
  Top 0.16: LED2.A 27.69,35.88 R22.1
N$30
  Top 0.16: XT1.3 34.29,28.05 33.86,27.62 33.86,26.02 33.63,25.79 U$3.6
NRST  (via drill 0.3)
  Top 0.16: U$3.7 31.73,26.29 v31.46,26.02 | v15.78,33.7 15.78,32.05 PROG.5
  Bottom 0.16: v31.46,26.02 31.46,26.34 32.42,27.3 32.42,30.98 28.26,35.14 17.22,35.14 v15.78,33.7
PHASA  (via drill 0.3)
  Top 0.16: U$1.9 9.54,17.54 9.54,17.06 8.26,15.78 8.26,11.64 6.54,9.92 6.54,7.49 7.08,7.4 7.11,7.4
  other vias: 10.86,5.3 10.86,5.9 10.86,6.5 10.86,7.1 10.86,7.7 7.26,5.3 7.26,5.9 7.26,6.5 7.26,7.1 7.26,7.7 7.86,5.3 7.86,5.9 7.86,6.5 7.86,7.1 7.86,7.7 8.46,5.3 8.46,5.9 8.46,6.5 8.46,7.1 8.46,7.7 9.06,5.3 9.06,5.9 9.06,6.5 9.06,7.1 9.06,7.7 9.66,5.3 9.66,5.9 9.66,6.5 9.66,7.1 9.66,7.7 10.26,5.3 10.26,5.9 10.26,6.5 10.26,7.1 10.26,7.7 7.26,4.7 7.86,4.7 8.46,4.7 9.06,4.7 9.66,4.7 10.26,4.7 10.86,4.7 2,5.31 2.6,5.31 3.2,5.31 3.8,5.31 4.4,5.31 4.4,4.71 3.8,4.71 3.2,4.71
  pour Top (isolate 0.254, no thermals): 1.75,5.72 5.15,5.72 5.15,4.25 6.62,4.25 6.62,7.95 11.71,7.95 11.75,5.85 12.2,5.45 12.2,0.45 1.75,0.3
  pour Route2 (isolate 0.254, no thermals): 1.75,5.88 6.79,5.88 6.79,8.12 11.85,8.12 11.8,0.45 1.75,0.3
PHASB  (via drill 0.3)
  Top 0.16: Q4.5 14.85,6.4 13.56,8 13.56,10.17 13.06,10.67 13.06,15.46 13.86,16.26 13.86,17.38 13.2,18.04 U$1.16
  other vias: 12.95,5.15 12.95,5.75 12.95,6.35 12.95,6.95 12.95,7.55 13.55,5.15 13.55,5.75 13.55,6.35 13.55,6.95 13.55,7.55 14.15,5.15 14.15,5.75 14.15,6.35 14.15,6.95 14.15,7.55 14.75,5.15 14.75,5.75 14.75,6.35 14.75,6.95 14.75,7.55 15.35,5.15 15.35,5.75 15.35,6.35 15.35,6.95 15.35,7.55 15.95,5.15 15.95,5.75 15.95,6.35 15.95,6.95 15.95,7.55 16.55,5.15 16.55,5.75 16.55,6.35 16.55,6.95 16.55,7.55 12.95,4.55 13.55,4.55 14.15,4.55 14.75,4.55 15.35,4.55 15.95,4.55 16.55,4.55 18.35,4.85 18.95,4.85 19.55,4.85 20.15,4.85 20.75,4.85 18.35,4.25 18.95,4.25 19.55,4.25 20.15,4.25 20.75,4.25
  pour Top (isolate 0.254, rank 2, no thermals): 12.65,7.65 12.65,3.95 12.61,3.95 12.61,0.3 21.45,0.3 21.45,5.35 17.05,5.35 17.05,7.65
  pour Route2 (isolate 0.254, rank 2, no thermals): 12.36,8.12 12.36,3.95 12.31,3.95 12.31,0.3 21.45,0.3 21.45,5.37 17.2,5.37 17.2,8.12
PHASC  (via drill 0.3)
  Top 0.16: v29.76,9.05 29.06,9.46 29.06,15.3 28.58,15.78 22.98,15.78 22.66,16.1 17.3,16.1 U$1.19
  other vias: 33.36,9.05 33.36,8.45 33.36,7.85 33.36,7.25 33.36,6.65 32.76,9.05 32.76,8.45 32.76,7.85 32.76,7.25 32.76,6.65 29.76,8.45 29.76,7.85 29.76,7.25 29.76,6.65 30.36,9.05 30.36,8.45 30.36,7.85 30.36,7.25 30.36,6.65 30.96,9.05 30.96,8.45 30.96,7.85 30.96,7.25 30.96,6.65 31.56,9.05 31.56,8.45 31.56,7.85 31.56,7.25 31.56,6.65 32.16,9.05 32.16,8.45 32.16,7.85 32.16,7.25 32.16,6.65 26.61,4.4 26.01,4.4 25.41,4.4 24.81,4.4 24.21,4.4 24.21,3.8 24.81,3.8 25.41,3.8 26.01,3.8 26.61,3.8
  pour Top (isolate 0.254, no thermals): 23.57,5.05 23.57,0.35 33.97,0.35 33.97,9.85 28.3,9.85 28.3,3.15 27.22,3.15 27.22,5.05
  pour Route2 (isolate 0.254, no thermals): 23.57,5.22 23.57,0.35 33.97,0.35 33.97,9.56 29.1,9.56 29.1,5.22
PWMA  (via drill 0.3)
  Top 0.16: U$1.41 8.55,25.55 v8.39,25.55 | 23.99,26.15 v24.02,26.15 23.81,25.94 22.26,25.94 22.11,25.79 U$3.43
  Bottom 0.16: v8.39,25.55 8.56,25.38 10.82,25.38 11.94,26.5 21.7,26.5 22.34,25.86 23.62,25.86 23.91,26.15 v24.02,26.15
PWMB  (via drill 0.3)
  Top 0.16: U$3.42 22.98,26.29 v23.27,26.6 | U$1.39 9.65,25.85 v9.79,26
  Bottom 0.16: v9.79,26 9.88,25.86 10.82,25.86 11.78,26.82 21.86,26.82 22.34,26.34 22.82,26.34 23.08,26.6 v23.27,26.6
PWMC  (via drill 0.3)
  Top 0.16: U$3.41 22.26,26.79 v22.52,27.05 | U$1.37 11.09,25.93 v11.09,26.9
  Bottom 0.16: v11.09,26.9 11.33,27.14 22.02,27.14 22.11,27.05 v22.52,27.05
SCK  (via drill 0.3)
  Top 0.16: v21.18,18.19 21.17,18.34 21.17,19.57 21.54,19.94 23.62,19.94 24.26,20.58 24.26,21.27 U$3.51
  Bottom 0.16: v21.18,18.19 20.74,17.75 U$11.12
SPA  (via drill 0.3)
  Top 0.16: 10.33,11.28 R7.2 10.7,11.15 10.7,12.3 10.58,12.42 9.22,12.42 8.9,12.74 8.9,15.46 U$1.11 | 10.33,11.28 10.1,11.4 | 10.33,11.29 10.33,11.28
  other vias: 9.35,10.4 9.95,10.4 10.55,10.4 11.15,10.4 11.75,10.4 11.75,11 11.15,11 10.55,11 9.95,11 9.35,11
  pour Top (isolate 0.254, rank 2, no thermals): 7.86,8.6 12.21,8.6 12.21,12.05 7.86,12.05
  pour Bottom (isolate 0.254): 6.82,12.1 12.74,12.1 12.74,10.18 8.74,10.18
SPB  (via drill 0.3)
  Top 0.16: R6.2 15.4,11.36 15.46,12.26 15.3,12.42 13.38,12.42 13.38,15.3 13.86,15.78 14.98,15.78 15.14,15.94 15.14,16.3 v15.16,16.32 | U$1.14 12.6,17.36 13.06,16.9 13.06,16.86 v12.28,16.08
  Bottom 0.16: v15.16,16.32 15.06,16.42 12.62,16.42 v12.28,16.08
  other vias: 14.45,10.4 15.05,10.4 15.65,10.4 16.25,10.4 16.85,10.4 16.85,11 16.25,11 15.65,11 15.05,11 14.45,11
  pour Top (isolate 0.254, rank 2, no thermals): 17.3,12.06 14,12.06 14,8.75 17.3,8.75
  pour Bottom (isolate 0.254): 13.38,12.1 16.74,12.1 18.66,10.18 13.38,10.18
SPI-MISO  (via drill 0.3)
  Top 0.16: U$3.22 28.28,31.62 v28.22,31.56 | R3.1 18.07,25.59 17.73,25.59 v16.81,24.67 16.81,24.33 16.26,23.78 15.1,23.78 U$1.29
  Bottom 0.16: v28.22,31.56 28.22,29.45 27.94,29.02 27.94,26.77 24.95,23.78 22.02,23.78 20.9,24.9 17.04,24.9 v16.81,24.67
SPI-MOSI  (via drill 0.3)
  Top 0.16: U$3.23 27.78,32.02 27.62,31.86 v27.62,30.96 | v15.77,24.34 15.93,24.41 15.62,24.1 14.7,24.1 U$1.30
  Bottom 0.16: v27.62,30.96 27.62,26.98 24.74,24.1 22.18,24.1 21.06,25.22 16.49,25.22 v15.77,24.34
SPI-NSS-DRV  (via drill 0.3)
  Top 0.16: U$3.20 29.28,31.26 27.62,29.6 v26.42,29.6 | v14.88,25.57 14.73,25.57 U$1.32
  Bottom 0.16: v14.88,25.57 15.17,25.86 21.38,25.86 22.5,24.74 24.42,24.74 26.82,27.14 26.82,29.22 26.44,29.6 v26.42,29.6
SPI-SCK  (via drill 0.3)
  Top 0.16: U$3.21 28.78,31.21 27.77,30.2 v27.02,30.2 | v15.62,25.25 15.62,25.06 14.98,24.42 14.3,24.42 U$1.31
  Bottom 0.16: v15.62,25.25 15.91,25.54 21.22,25.54 22.34,24.42 24.58,24.42 27.3,27.14 27.3,29.7 27.02,29.98 v27.02,30.2
SW
  Top 0.26: 6.63,24.63 D1.C 6.39,24.62 | C4.1 6.06,26.98
  Top 0.3: U$1.45 6.63,24.63
  pour Top (no thermals): 1.54,26.98 6.18,26.98 6.18,23.46 4.74,23.46 4.74,25.54 1.54,25.54
TCK  (via drill 0.3)
  Top 0.16: U$3.49 23.28,22.71 25.07,24.5 25.07,27.65 v23.42,29.3 | v18.83,31.1 18.74,31.1 PROG.2
  Bottom 0.16: v23.42,29.3 20.63,29.3 v18.83,31.1
TMS  (via drill 0.3)
  Top 0.16: U$3.46 23.96,24.29 24.62,24.95 24.62,27.35 23.27,28.7 v22.65,28.7 | v16.83,31.1 16.74,31.1 PROG.4
  Bottom 0.16: v22.65,28.7 19.23,28.7 v16.83,31.1
USART_RX  (via drill 0.3)
  Top 0.16: v31.62,33.86 31.62,33.63 U$3.17 | PROG.7 v13.73,33.81
  Bottom 0.16: v13.73,33.81 15.97,36.05 29.43,36.05 v31.62,33.86
USART_TX  (via drill 0.3)
  Top 0.16: v32.87,31.55 32.87,30.88 U$3.16 | PROG.6 14.67,32.01 v14.67,33.77
  Bottom 0.16: v32.87,31.55 32.72,31.7 32.31,31.7 28.39,35.62 16.52,35.62 v14.67,33.77
VCP
  Top 0.16: C6.2 7.34,18.18 U$1.5
(copper drawn outside any net)
  shapes: Top area x1

### Text on the board
tNames: LAIKA Driver / V1.0 / Gabriel Bettanin / 11/20 | :P | - | + | U | V | W